# Altium schematic sheet can_uart.SchDoc: CAN and UART Interfaces
size A4; Organization: Badgerloop Electrical; Address1: 133 Engineering Research Building; Address2: 1500 Engineering Drive; Address3: Madison, Wi 53706; SheetNumber: 7
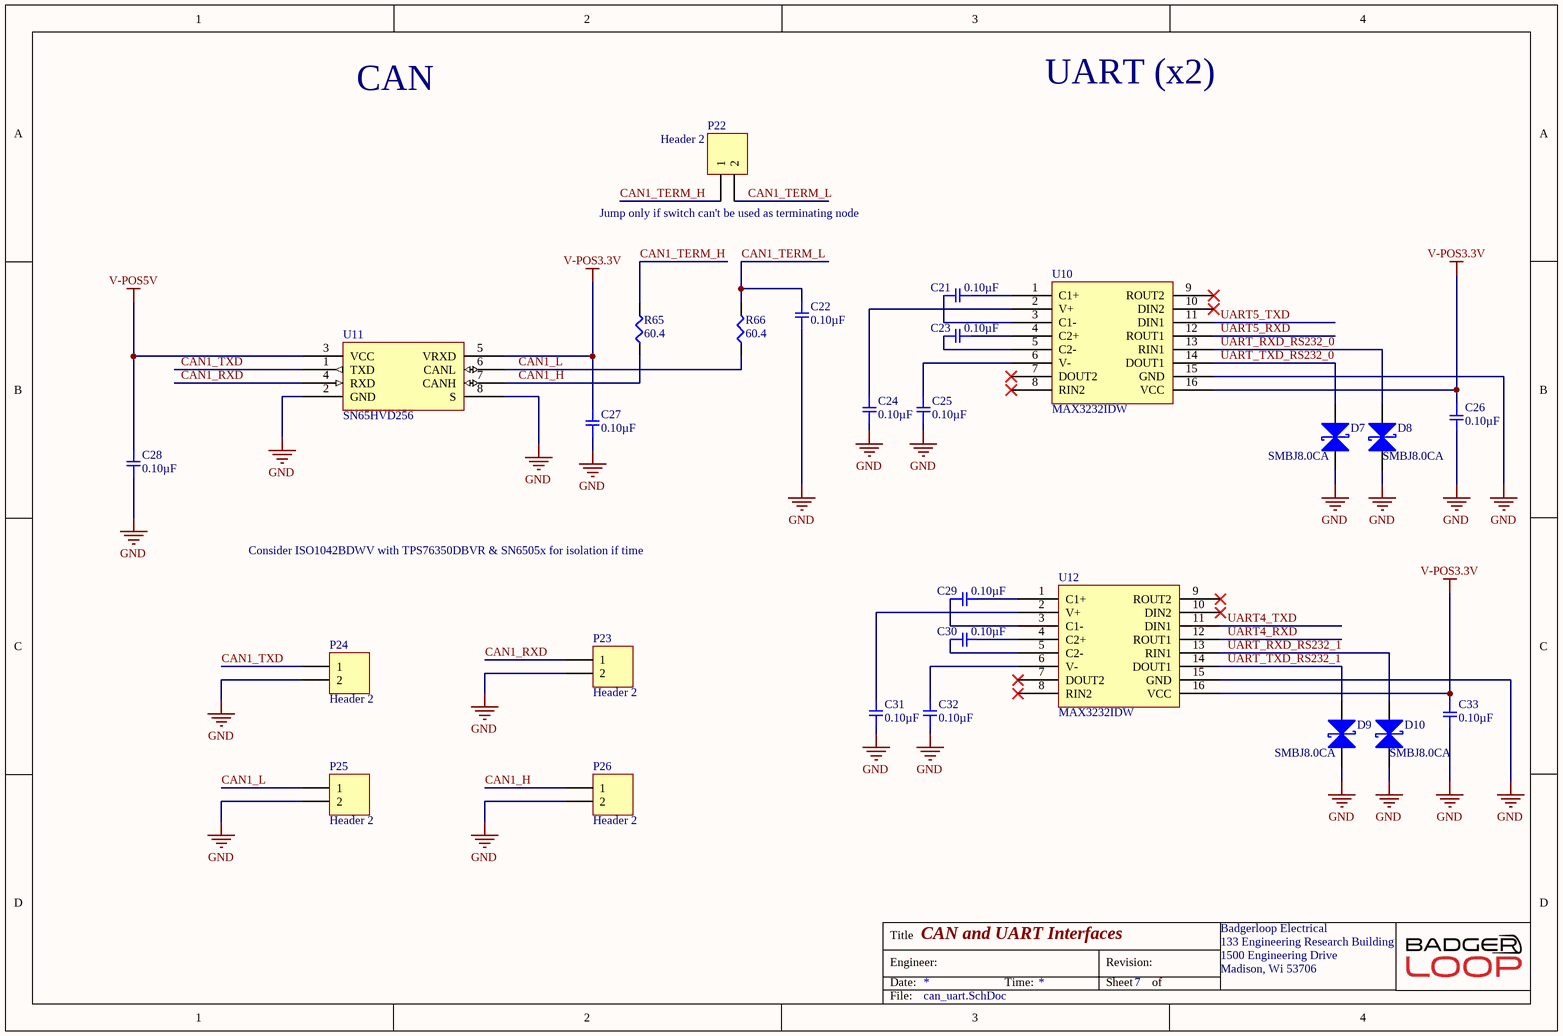
[diagram p0: can_uart.SchDoc]

## Parts
C21  0.10µF  [SMD-0805C]
C22  0.10µF  [SMD-0805C]
C23  0.10µF  [SMD-0805C]
C24  0.10µF  [SMD-0805C]
C25  0.10µF  [SMD-0805C]
C26  0.10µF  [SMD-0805C]
C27  0.10µF  [SMD-0805C]
C28  0.10µF  [SMD-0805C]
C29  0.10µF  [SMD-0805C]
C30  0.10µF  [SMD-0805C]
C31  0.10µF  [SMD-0805C]
C32  0.10µF  [SMD-0805C]
C33  0.10µF  [SMD-0805C]
D7  SMBJ8.0CA  [DIOM4436X26N]
D8  SMBJ8.0CA  [DIOM4436X26N]
D9  SMBJ8.0CA  [DIOM4436X26N]
D10  SMBJ8.0CA  [DIOM4436X26N]
P22  Header 2  [Pin Header 1x2 TH Pitch 2.54mm]
P23  Header 2  [Pin Header 1x2 TH Pitch 2.54mm]
P24  Header 2  [Pin Header 1x2 TH Pitch 2.54mm]
P25  Header 2  [Pin Header 1x2 TH Pitch 2.54mm]
P26  Header 2  [Pin Header 1x2 TH Pitch 2.54mm]
R65  60.4  [SMD-1206-RES]
R66  60.4  [SMD-1206-RES]
U10  MAX3232IDW  [SOP127P1060X175-16N]
U11  SN65HVD256  [SOIC127P610X280-8N]
U12  MAX3232IDW  [SOP127P1060X175-16N]

## Nets
GND: C22.1 C24.1 C25.1 C26.2 C27.1 C28.1 C31.1 C32.1 C33.2 D7.1(A) D8.1(A) D9.1(A) D10.1(A) P23.2 P24.2 P25.2 P26.2 U10.15(GND) U11.2(GND) U11.8(S) U12.15(GND)
V-POS3.3V: C26.1 C27.2 C33.1 U10.16(VCC) U11.5(VRXD) U12.16(VCC)
V-POS5V: C28.2 U11.3(VCC)
CAN1_H: P26.1 R65.1 U11.7(CANH)
CAN1_L: P25.1 R66.1 U11.6(CANL)
CAN1_RXD: P23.1 U11.4(RXD)
CAN1_TERM_H: P22.1 R65.2
CAN1_TERM_L: C22.2 P22.2 R66.2
CAN1_TXD: P24.1 U11.1(TXD)
UART4_RXD: U12.12(ROUT1)
UART4_TXD: U12.11(DIN1)
UART5_RXD: U10.12(ROUT1)
UART5_TXD: U10.11(DIN1)
UART_RXD_RS232_0: D8.2(K) U10.13(RIN1)
UART_RXD_RS232_1: D10.2(K) U12.13(RIN1)
UART_TXD_RS232_0: D7.2(K) U10.14(DOUT1)
UART_TXD_RS232_1: D9.2(K) U12.14(DOUT1)
NetC21_1: C21.1 U10.3(C1-)
NetC21_2: C21.2 U10.1(C1+)
NetC23_1: C23.1 U10.5(C2-)
NetC23_2: C23.2 U10.4(C2+)
NetC24_2: C24.2 U10.2(V+)
NetC25_2: C25.2 U10.6(V-)
NetC29_1: C29.1 U12.3(C1-)
NetC29_2: C29.2 U12.1(C1+)
NetC30_1: C30.1 U12.5(C2-)
NetC30_2: C30.2 U12.4(C2+)
NetC31_2: C31.2 U12.2(V+)
NetC32_2: C32.2 U12.6(V-)

Not connected (* = marked no-connect by the designer): U10 7(DOUT2)* 8(RIN2)* 9(ROUT2)* 10(DIN2)*; U12 7(DOUT2)* 8(RIN2)* 9(ROUT2)* 10(DIN2)*

## Notes on the sheet
- CAN
- UART (x2)
- (near P22) Jump only if switch can't be used as terminating node
- Consider ISO1042BDWV with TPS76350DBVR & SN6505x for isolation if time
- Title
- Engineer:
- Date:
- Time:
- Revision:
- Sheet
- of
- File:

## Library data of the parts
C21-C25 C27-C32 = GRM219R71C104JA01D: CAP CER 0.1UF 16V X7R 0805; Manufacturer: Murata Electronics North America; Factory Stock: 0; Unit Price (USD): 0.12; Minimum Quantity: 1; Tolerance: ±5%; Datasheets: -; Image: //media.digikey.com/Renders/Murata%20Renders/0805%20(2012%20Metric)%20.85mm.jpg; Digi-Key Part Number: 490-12557-1-ND; Part Number: GRM219R71C104JA01D; Quantity Available: 6635; @ qty: 0; Packaging: Cut Tape (CT); Series: GRM; Part Status: Active; Value: 0.10µF; Voltage: 16V; Temperature Coefficient: X7R; Operating Temperature: -55°C ~ 125°C; Features: -; Ratings: -; Applications: General Purpose; Mounting Type: Surface Mount, MLCC; Package / Case: 0805 (2012 Metric); Size / Dimension: 0.079" L x 0.049" W (2.00mm x 1.25mm); Height - Seated (Max): -; Thickness (Max): 0.037" (0.95mm); Lead Spacing: -; Lead Style: -
C26 C33 = GRM219R71E104KA01D: CAP CER 0.1UF 25V X7R 0805; Manufacturer: Murata Electronics North America; Factory Stock: 0; Unit Price (USD): 0.12; Minimum Quantity: 1; Tolerance: ±10%; Datasheets: http://www.murata.com/~/media/webrenewal/support/library/catalog/products/capacitor/mlcc/c02e.pdf; Image: //media.digikey.com/Renders/Murata%20Renders/0805%20(2012%20Metric)%20.85mm.jpg; Digi-Key Part Number: 490-12754-1-ND; Part Number: GRM219R71E104KA01D; Quantity Available: 8594; @ qty: 0; Packaging: Cut Tape (CT); Series: GRM; Part Status: Active; Value: 0.10µF; Voltage: 25V; Temperature Coefficient: X7R; Operating Temperature: -55°C ~ 125°C; Features: -; Ratings: -; Applications: General Purpose; Mounting Type: Surface Mount, MLCC; Package / Case: 0805 (2012 Metric); Size / Dimension: 0.079" L x 0.049" W (2.00mm x 1.25mm); Height - Seated (Max): -; Thickness (Max): 0.037" (0.95mm); Lead Spacing: -; Lead Style: -
D7-D10 = SMBJ8.0CA: TVS DIODE 8V 13.6V DO214AA; Manufacturer: Littelfuse; Polarity: Bidirectional; Peak Pulse Power: 600W; Max Surge Current: 44.2A; Breakdown Voltage: 8.89V; Test Current: 1mA; Number of Channels: 1; Leakage Current: 100uA; Power Line Protection: No; Max Breakdown Voltage: 9.83V; Supplier 1: Digi-Key; Stock 1: 700; Pricing 1: 1=0.39, 10=0.313, 25=0.2864, 100=0.1798, 250=0.17784, 500=0.1665, 1000=0.11322 (USD); Mount: Surface Mount; Case/Package: SMB; Number of Pins: 2; Min Operating Temperature: -65°C; Max Operating Temperature: 150°C; Packaging: Tape and Reel; Clamping Voltage: 13.6V; Package Quantity: 3000; Reverse Standoff Voltage: 8V; Min Breakdown Voltage: 8.89V; Peak Pulse Current: 44.2A; Direction: Bidirectional; Reverse Breakdown Voltage: 8.89V; Operating Supply Voltage: 8V; Termination: SMD/SMT; Number of Elements: 1; Number of Bidirectional Channels: 1; Composition: Zener; Max Power Dissipation: 600W; Voltage Rating (DC): 8V; Power Dissipation: 600W; Length: 5.59mm; Height: 2.44mm; Width: 3.94mm; Lead Free: Lead Free; REACH SVHC: No SVHC; ComponentLink1URL: http://www.littelfuse.com/~/media/electronics/datasheets/tvs_diodes/littelfuse_tvs_diode_smbj_datasheet.pdf.pdf?src-supplier=Digi-Key; ComponentLink1Description: http://www.littelfuse.com/~/media/electronics/datasheets/tvs_diodes/littelfuse_tvs_diode_smbj_datasheet.pdf.pdf?src-supplier=Digi-Key; ComponentLink2URL: http://www.littelfuse.com/data/en/Data_Sheets/Littelfuse_TVS-Diode_SMBJ.pdf?src-supplier=Element14; ComponentLink2Description: http://www.littelfuse.com/data/en/Data_Sheets/Littelfuse_TVS-Diode_SMBJ.pdf?src-supplier=Element14; Supplier Part Number 1: SMBJ8.0CALFCT-ND
P22-P26 = Header 2: Header, 2-Pin; LatestRevisionDate: 17-Jul-2002; LatestRevisionNote: Re-released for DXP Platform.; Publisher: Altium Limited
R65 R66 = ERJ-8ENF60R4V: RES SMD 60.4 OHM 1% 1/4W 1206; Manufacturer: Panasonic Electronic Components; Factory Stock: 0; Unit Price (USD): 0.00933; @ qty: 1500; Minimum Quantity: 1; Power (Watts): 0.25W, 1/4W; Temperature Coefficient: ±100ppm/°C; Part Number: ERJ-8ENF60R4V; Datasheets: http://industrial.panasonic.com/www-cgi/jvcr13pz.cgi?E+PZ+3+AOA0002+ERJ8ENF60R4V+7+WW; Image: //media.digikey.com/Renders/Panasonic%20Renders/ERJ-1206%20Pkg.jpg; Digi-Key Part Number: P60.4FCT-ND; Quantity Available: 94102; Packaging: Cut Tape (CT); Series: ERJ; Part Status: Active; Value: 60.4; Tolerance: ±1%; Composition: Thick Film; Features: Automotive AEC-Q200; Operating Temperature: -55°C ~ 155°C; Package / Case: 1206 (3216 Metric); Supplier Device Package: 1206; Size / Dimension: 0.126" L x 0.063" W (3.20mm x 1.60mm); Height - Seated (Max): 0.028" (0.70mm); Number of Terminations: 2; Failure Rate: -
U10 U12 = MAX3232IDW: IC DRVR/RCVR MULTCH RS232 16SOIC; Manufacturer: Texas Instruments; Number of Transmitters: 2; Max Supply Voltage: 5.5V; Min Supply Voltage: 3V; Nominal Supply Current: 1mA; Data Rate: 250Kbps; Logic Function: Transceiver,Receiver; Number of Transceivers: 1; Operating Supply Voltage: 5V; Simplex/Duplex: Full Duplex; Output Voltage: 5.4V; Output Current: 60mA; Supplier 1: Digi-Key; Stock 1: 419; Pricing 1: 1=2.15, 10=1.927, 25=1.818, 100=1.4543, 250=1.27252, 500=1.23618, 1000=0.98167, 2500=0.9604 (USD); Mount: Surface Mount; Case/Package: SOIC; Number of Pins: 16; Weight: 0.014829oz; Min Operating Temperature: -40°C; Max Operating Temperature: 85°C; Packaging: Rail/Tube; Number of Receivers: 2; Package Quantity: 40; Number of Drivers: 2; Length: 10.28mm; Width: 7.52mm; Height: 2.35mm; Radiation Hardening: No; Lead Free: Lead Free; RoHS Compliant: Yes; REACH SVHC: No SVHC; ComponentLink1URL: http://www.farnell.com/datasheets/1823586.pdf?src-supplier=Element14; ComponentLink1Description: http://www.farnell.com/datasheets/1823586.pdf?src-supplier=Element14; ComponentLink2URL: http://www.ti.com/lit/ds/symlink/max3232.pdf?src-supplier=Digi-Key; ComponentLink2Description: http://www.ti.com/lit/ds/symlink/max3232.pdf?src-supplier=Digi-Key; ComponentLink3URL: http://focus.ti.com/lit/ds/symlink/max3232.pdf?src-supplier=Avnet+Europe; ComponentLink3Description: http://focus.ti.com/lit/ds/symlink/max3232.pdf?src-supplier=Avnet+Europe; ComponentLink4URL: http://www.produktinfo.conrad.com/datenblaetter/1100000-1199999/001187156-da-01-en-IC_DRVR_RCVR_MULT_MAX3232IDW_SOIC_16_TID.pdf?src-supplier=Conrad; ComponentLink4Description: http://www.produktinfo.conrad.com/datenblaetter/1100000-1199999/001187156-da-01-en-IC_DRVR_RCVR_MULT_MAX3232IDW_SOIC_16_TID.pdf?src-supplier=Conrad; Supplier Part Number 1: 296-26159-5-ND
U11 = SN65HVD256: IC TXRX CAN 5V HS 8SOIC; Manufacturer: TI; Manufacturer P/N: SN65HVD256DR; Digikey P/N: 296-30093-1-ND; Digikey Link: https://www.digikey.com/product-detail/en/texas-instruments/SN65HVD256DR/296-30093-1-ND/2798832